# EAGLE design Wilssen_core_v0.208a (EAGLE 6.3)
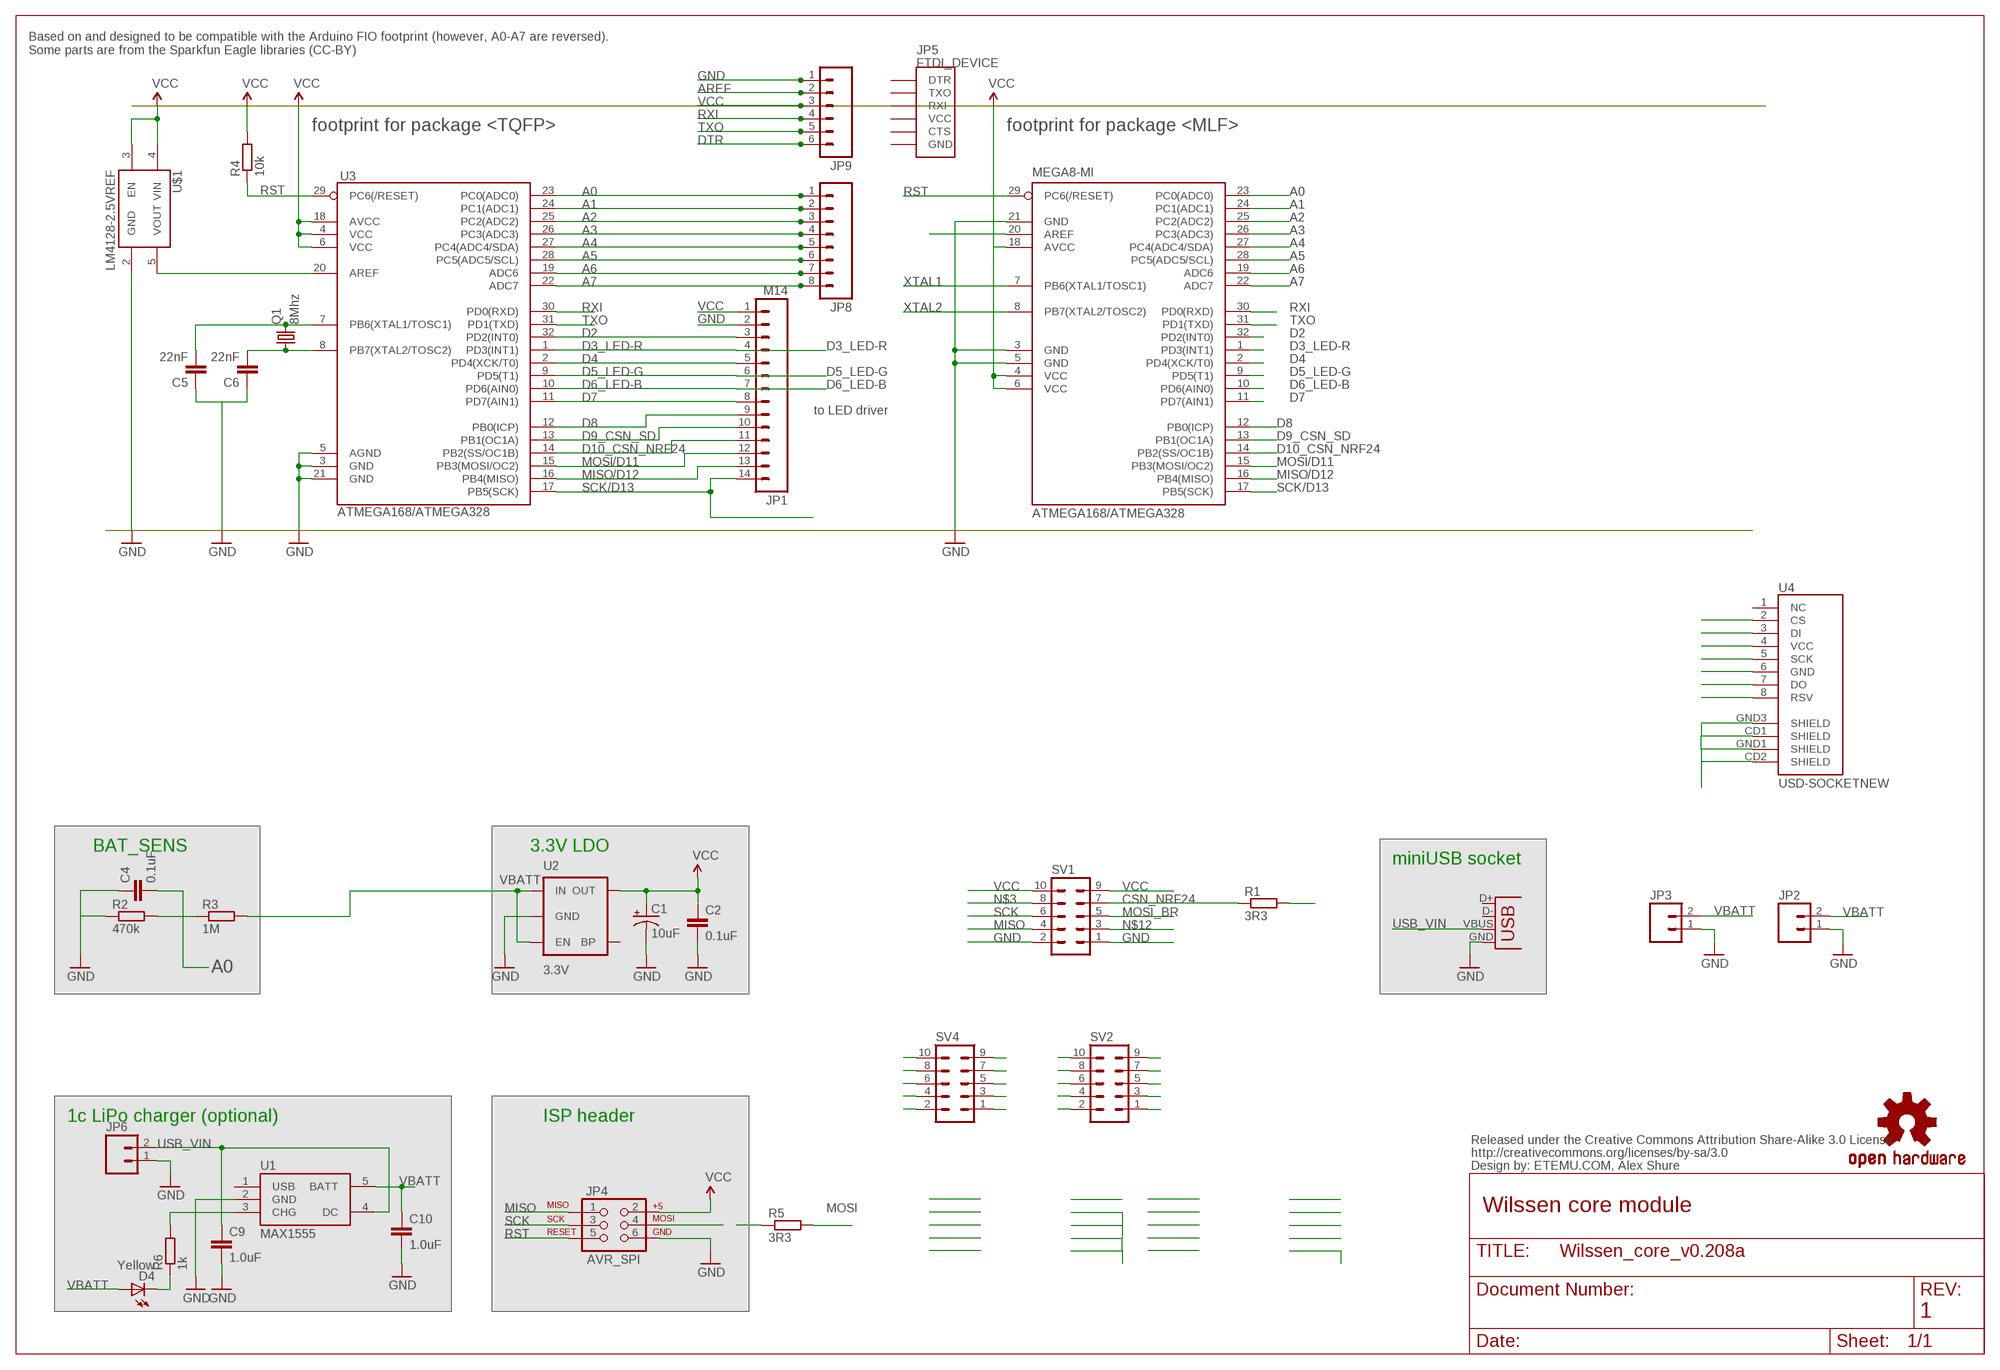
[diagram p0: schematic, sheet 1, part 1 of 2]
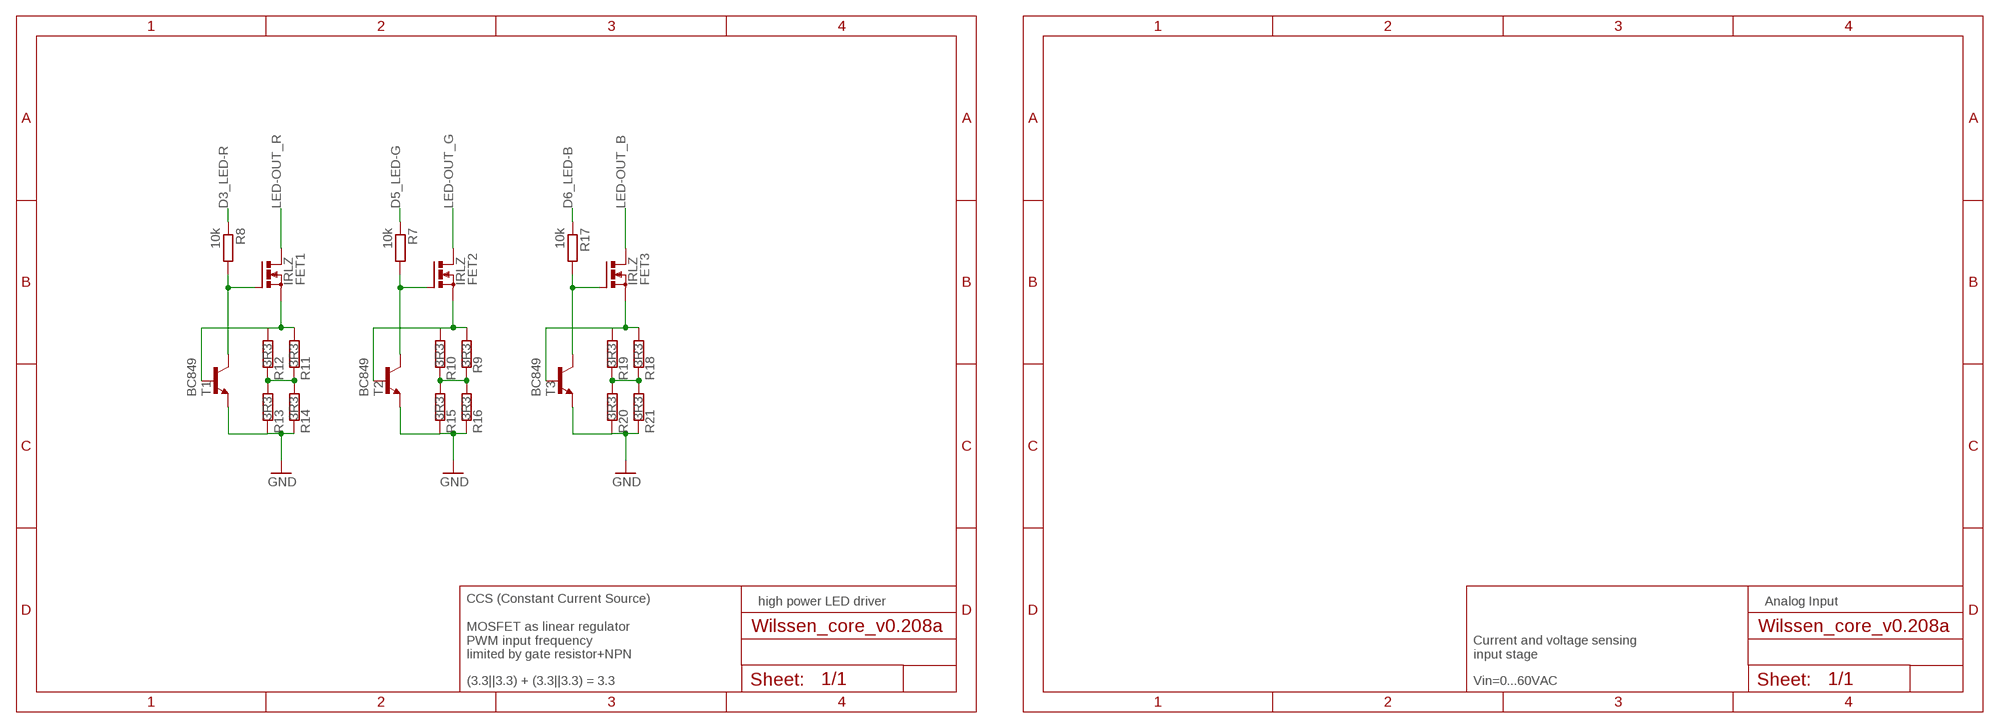
[diagram p1: schematic, sheet 1, part 2 of 2]

## Parts
ATMEGA168/ATMEGA328  MEGA8-MI  [MLF32]
C1  10uF  CAP_POL1206  [EIA3216]
C2  0.1uF  CAP0805  [0805]
C4  0.1uF  CAP0805  [0805]
C5  22nF  CAP0805  [0805]
C6  22nF  CAP0805  [0805]
C9  1.0uF  CAP0805  [0805]
C10  1.0uF  CAP0805  [0805]
CC_TEXT1  CREATIVE_COMMONS  [CREATIVE_COMMONS]
D4  Yellow  LED0603  [LED-0603]
FET1  IRLZ  PMOSFET_NTO220BV  [TO220BV]
FET2  IRLZ  PMOSFET_NTO220BV  [TO220BV]
FET3  IRLZ  PMOSFET_NTO220BV  [TO220BV]
JP1  M14  [1X14]
JP2  M02PTH  [1X02]
JP3  M02-JST-2MM-SMT  [S2B-PH]
JP4  AVR_SPI  AVR_SPI_PRG_6PTH  [2X3]
JP5  FTDI_DEVICE  [FTDI_DEVICE_SIDE]
JP6  M02PTH  [1X02]
JP8  M081X08  [1X08]
JP9  M06SIP  [1X06]
LOGO1  OSHW-LOGOS  [OSHW-LOGO-S]
Q1  8Mhz  CRYSTALSM49  [SM49]
R1  3R3  R-EU_R1206  [R1206]
R2  470k  R-EU_R0805  [R0805]
R3  1M  R-EU_R0805  [R0805]
R4  10k  R-EU_R0805  [R0805]
R5  3R3  R-EU_R1206  [R1206]
R6  1k  R-EU_R0805  [R0805]
R7  10k  R-EU_R0805  [R0805]
R8  10k  R-EU_R0805  [R0805]
R9  3R3  R-EU_R1206  [R1206]
R10  3R3  R-EU_R1206  [R1206]
R11  3R3  R-EU_R1206  [R1206]
R12  3R3  R-EU_R1206  [R1206]
R13  3R3  R-EU_R1206  [R1206]
R14  3R3  R-EU_R1206  [R1206]
R15  3R3  R-EU_R1206  [R1206]
R16  3R3  R-EU_R1206  [R1206]
R17  10k  R-EU_R0805  [R0805]
R18  3R3  R-EU_R1206  [R1206]
R19  3R3  R-EU_R1206  [R1206]
R20  3R3  R-EU_R1206  [R1206]
R21  3R3  R-EU_R1206  [R1206]
SV1  MA05-2  [MA05-2]
SV2  MA05-2  [MA05-2]
SV4  MA05-2  [MA05-2]
T1  BC849  [SOT23]
T2  BC849  [SOT23]
T3  BC849  [SOT23]
U1  MAX1555  [SOT23-5]
U2  3.3V  V_REG_LDOSMD  [SOT23-5]
U3  ATMEGA168/ATMEGA328  ATMEGA168  [TQFP32-08]
U4  USD-SOCKETNEW  [MICRO-SD-SOCKET-PP]
U$1  LM4128-2.5VREF  [SOT23-5]
X1  USBSMD  [USB-MINIB]

## Nets
A0: ATMEGA168/ATMEGA328.23(PC0(ADC0)) C4.2 JP8.1 R2.2 R3.1 U3.23(PC0(ADC0))
A1: ATMEGA168/ATMEGA328.24(PC1(ADC1)) JP8.2 U3.24(PC1(ADC1))
A2: ATMEGA168/ATMEGA328.25(PC2(ADC2)) JP8.3 U3.25(PC2(ADC2))
A3: ATMEGA168/ATMEGA328.26(PC3(ADC3)) JP8.4 U3.26(PC3(ADC3))
A4: ATMEGA168/ATMEGA328.27(PC4(ADC4/SDA)) JP8.5 U3.27(PC4(ADC4/SDA))
A5: ATMEGA168/ATMEGA328.28(PC5(ADC5/SCL)) JP8.6 U3.28(PC5(ADC5/SCL))
A6: ATMEGA168/ATMEGA328.19(ADC6) JP8.7 U3.19(ADC6)
A7: ATMEGA168/ATMEGA328.22(ADC7) JP8.8 U3.22(ADC7)
AREF: ATMEGA168/ATMEGA328.20(AREF) JP9.2 U3.20(AREF) U$1.5(VOUT)
CSN: SV2.8 SV4.8
CSN_NRF24: R1.1 SV1.7
D2: ATMEGA168/ATMEGA328.32(PD2(INT0)) JP1.3 U3.32(PD2(INT0))
D3_LED-R: ATMEGA168/ATMEGA328.1(PD3(INT1)) JP1.4 R8.1 U3.1(PD3(INT1))
D4: ATMEGA168/ATMEGA328.2(PD4(XCK/T0)) JP1.5 U3.2(PD4(XCK/T0))
D5_LED-G: ATMEGA168/ATMEGA328.9(PD5(T1)) JP1.6 R7.1 U3.9(PD5(T1))
D6_LED-B: ATMEGA168/ATMEGA328.10(PD6(AIN0)) JP1.7 R17.1 U3.10(PD6(AIN0))
D7: ATMEGA168/ATMEGA328.11(PD7(AIN1)) JP1.8 U3.11(PD7(AIN1))
D8: ATMEGA168/ATMEGA328.12(PB0(ICP)) JP1.9 U3.12(PB0(ICP))
D9_CSN_SD: ATMEGA168/ATMEGA328.13(PB1(OC1A)) JP1.10 U3.13(PB1(OC1A)) U4.2(CS)
D10_CSN_NRF24: ATMEGA168/ATMEGA328.14(PB2(SS/OC1B)) JP1.11 R1.2 U3.14(PB2(SS/OC1B))
DTR: JP9.6
GATE1: FET1.G R8.2 T1.3(C)
GATE2: FET2.G R7.2 T2.3(C)
GATE3: FET3.G R17.2 T3.3(C)
GND: ATMEGA168/ATMEGA328.3(GND) ATMEGA168/ATMEGA328.5(GND) ATMEGA168/ATMEGA328.21(GND) C1.C(-) C2.2 C4.1 C5.1 C6.1 C9.2 C10.2 JP1.2 JP2.1 JP3.1 JP4.6 JP6.1 JP9.1 R2.1 R13.2 R14.2 R15.2 R16.2 R20.2 R21.2 SV1.1 SV1.2 SV4.1 SV4.3 SV4.5 SV4.7 T1.2(E) T2.2(E) T3.2(E) U1.2(GND) U2.2(GND) U3.3(GND) U3.5(AGND) U3.21(GND) U4.6(GND) U4.CD1(SHIELD) U4.CD2(SHIELD) U4.GND1(SHIELD) U4.GND3(SHIELD) U$1.2(GND) X1.GND
LED-OUT_B: FET3.D
LED-OUT_G: FET2.D
LED-OUT_R: FET1.D
MISO: ATMEGA168/ATMEGA328.16(PB4(MISO)) JP1.13 JP4.1 SV1.4 SV2.2 SV4.2 U3.16(PB4(MISO))
MOSI: ATMEGA168/ATMEGA328.15(PB3(MOSI/OC2)) JP1.12 JP4.4 R5.2 SV2.10 SV4.10 U3.15(PB3(MOSI/OC2))
MOSI_BR: SV1.5
N$1: R5.1
N$3: SV1.8
N$5: U4.3(DI)
N$8: D4.C R6.1
N$11: R6.2 U1.3(CHG)
N$12: SV1.3
N$15: U4.7(DO)
N$16: U4.8(RSV)
NS$1: R11.2 R12.2 R13.1 R14.1
NS$2: R9.2 R10.2 R15.1 R16.1
NS$3: R18.2 R19.2 R20.1 R21.1
RST: ATMEGA168/ATMEGA328.29(PC6(/RESET)) JP4.5 R4.1 SV2.6 SV4.6 U3.29(PC6(/RESET))
RXI: ATMEGA168/ATMEGA328.30(PD0(RXD)) JP9.4 U3.30(PD0(RXD))
SCK: ATMEGA168/ATMEGA328.17(PB5(SCK)) JP1.14 JP4.3 SV1.6 SV2.4 SV4.4 U3.17(PB5(SCK)) U4.5(SCK)
SRC1: FET1.S R11.1 R12.1 T1.1(B)
SRC2: FET2.S R9.1 R10.1 T2.1(B)
SRC3: FET3.S R18.1 R19.1 T3.1(B)
TXO: ATMEGA168/ATMEGA328.31(PD1(TXD)) JP9.5 U3.31(PD1(TXD))
USB_VIN: C9.1 JP6.2 U1.4(DC) X1.VBUS
VBATT: C10.1 D4.A JP2.2 JP3.2 R3.2 U1.5(BATT) U2.1(IN) U2.3(EN)
VCC [VCC]: ATMEGA168/ATMEGA328.4(VCC) ATMEGA168/ATMEGA328.6(VCC) ATMEGA168/ATMEGA328.18(AVCC) C1.A(+) C2.1 JP1.1 JP4.2 JP9.3 R4.2 SV1.9 SV1.10 SV4.9 U2.5(OUT) U3.4(VCC) U3.6(VCC) U3.18(AVCC) U4.4(VCC) U$1.3(EN) U$1.4(VIN)
XTAL1: ATMEGA168/ATMEGA328.7(PB6(XTAL1/TOSC1)) C5.2 Q1.2 U3.7(PB6(XTAL1/TOSC1))
XTAL2: ATMEGA168/ATMEGA328.8(PB7(XTAL2/TOSC2)) C6.2 Q1.1 U3.8(PB7(XTAL2/TOSC2))
Unconnected: JP5.P$1(DTR) JP5.P$2(TXO) JP5.P$3(RXI) JP5.P$4(VCC) JP5.P$5(CTS) JP5.P$6(GND) SV2.1 SV2.3 SV2.5 SV2.7 SV2.9 U1.1(USB) U2.4(BP) U4.1(NC) X1.D+ X1.D-

## Notes on the sheet
- Based on and designed to be compatible with the Arduino FIO footprint (however, A0-A7 are reversed).
  Some parts are from the Sparkfun Eagle libraries (CC-BY)
- footprint for package <TQFP> | footprint for package <MLF>
- to LED driver
- /D11 | /D11
- /D12 | /D12
- /D13 | /D13
- BAT_SENS | 3.3V LDO
- miniUSB socket
- 1c LiPo charger (optional) | ISP header
- ETEMU.COM, Alex Shure
- Wilssen core module
- high power LED driver | Analog Input
- CCS (Constant Current Source)
  
  MOSFET as linear regulator
  PWM input frequency
  limited by gate resistor+NPN
- Current and voltage sensing
  input stage
- 1
- (3.3||3.3) + (3.3||3.3) = 3.3 | Vin=0...60VAC

## Library data of the parts
ATMEGA168/ATMEGA328 = atmel:MEGA8: MICROCONTROLLER 8 Kbytes FLASH, 1 kbytes SRAM, 512 bytes EEPROM, USART, 6-channel 10 bit ADC, 2-channel 8 bit ADC Pin compatible with Atmega48, ATMega88, ATMega168 Source: avr.lbr; MPN: ATMEGA88PA-MU; OC_FARNELL: 1715491; OC_NEWARK: 15R0272
C1 = SparkFun:CAP_POL: Capacitor Polarized These are standard SMD and PTH capacitors. Normally 10uF, 47uF, and 100uF in electrolytic and tantalum varieties. Always verify the external diameter of the through hole cap, it varies with capacity, voltage, and manufacturer. The EIA devices should be standard.
C2 C4-C6 C9 C10 = SparkFun:CAP: Capacitor Standard 0603 ceramic capacitor, and 0.1" leaded capacitor.
CC_TEXT1 = SparkFun-Aesthetics:CREATIVE_COMMONS: Creative Commons License summary
D4 = SparkFun:LED: LEDs Standard schematic elements and footprints for 5mm, 3mm, 1206, and 0603 sized LEDs. 5mm - Spark Fun Electronics SKU : COM-00529 (and others)
FET1-FET3 = transistor-power:PMOSFET_N: Power MOSFET N-Channel
JP1 = SparkFun:M14: Header 14 Standard 14-pin 0.1" header. Use with straight break away headers (SKU : PRT-00116), right angle break away headers (PRT-00553), swiss pins (PRT-00743), machine pins (PRT-00117), and female headers (PRT-00115).
JP2 JP3 JP6 = SparkFun:M02: Header 2 Standard 2-pin 0.1" header. Use with straight break away headers (SKU : PRT-00116), right angle break away headers (PRT-00553), swiss pins (PRT-00743), machine pins (PRT-00117), and female headers (PRT-00115). Molex polarized connector foot print use with SKU : PRT-08233 with associated crimp pins and housings.
JP4 = SparkFun:AVR_SPI_PRG_6: AVR ISP 6 Pin This is the reduced ISP connector for AVR programming. Common on Arduino. This footprint will take up less PCB space and can be used with a 10-pin to 6-pin adapter such as SKU: BOB-08508
JP5 = SparkFun-Connectors:FTDI_DEVICE: Connector which mates to FTDI basic or FTDI cable.
JP8 = SparkFun-Connectors:M08: Header 8 Standard 8-pin 0.1" header. Use with straight break away headers (SKU : PRT-00116), right angle break away headers (PRT-00553), swiss pins (PRT-00743), machine pins (PRT-00117), and female headers (PRT-00115).
JP9 = SparkFun-Connectors:M06: Header 6 Standard 6-pin 0.1" header. Use with straight break away headers (SKU : PRT-00116), right angle break away headers (PRT-00553), swiss pins (PRT-00743), machine pins (PRT-00117), and female headers (PRT-00115). Molex polarized connector foot print use with SKU : PRT-08094 with associated crimp pins and housings. NOTES ON THE VARIANTS LOCK and LOCK_LONGPADS... This footprint was designed to help hold the alignment of a through-hole component (i.e. 6-pin header) while soldering it into place. You may notice that each hole has been shifted either up or down by 0.005 of an inch from it's more standard position (which is a perfectly straight line). This slight alteration caused the pins (the squares in the middle) to touch the edges of the holes. Because they are alternating, it causes a "brace" to hold the component in place. 0.005 has proven to be the perfect amount of "off-center" position when using our standard breakaway headers. Although looks a little odd when you look at the bare footprint, once you have a header in there, the alteration is very hard to notice. Also, if you push a header all the way into place, it is covered up entirely on the bottom side. This idea of altering the position of holes to aid alignment will be further integrated into the Sparkfun Library for other footprints. It can help hold any component with 3 or more connection pins.
LOGO1 = SparkFun-Aesthetics:OSHW-LOGO: Open Source Hardware Logo This logo indicates the piece of hardware it is found on incorporates a OSHW license and/or adheres to the definition of open source hardware found here: http://freedomdefined.org/OSHW
Q1 = crystal:CRYSTAL: CRYSTAL; OC_FARNELL: unknown; OC_NEWARK: unknown
R1-R6 = rcl:R-EU_: RESISTOR, European symbol
R7-R21 = resistor:R-EU_: RESISTOR, European symbol
SV1 SV2 SV4 = con-lstb:MA05-2: PIN HEADER; OC_FARNELL: unknown; OC_NEWARK: unknown
T1-T3 = transistor:BC849: NPN TRANSISTOR
U1 = SparkFun:MAX1555: MAX1555 Lithium Charger IC SOT-23 Lithium Polymer charging IC. Schematic element and footprint proven. Spark Fun Electronics SKU : COM-00674
U2 = SparkFun:V_REG_LDO: Voltage Regulator LDO Standard 150mA LDO voltage regulator in SOT-23 layout. Micrel part MIC5205. BP (by-pass) pin is used to lower output noise with 470pF cap.
U3 = SparkFun:ATMEGA168
U4 = SparkFun-Connectors:USD-SOCKET: microSD Socket Push-push type uSD socket. Schematic element and footprint production proven. Spark Fun Electronics SKU : PRT-00127. tDoc lines correctly indicate media card edge positions when inserting (unlocked, locked, depressed).
U$1 = SparkFun-PowerIC:LM4128-2.5VREF: .1% accurate low-current voltage reference
X1 = SparkFun:USB: USB Connectors USB-B-PTH is fully proven SKU : PRT-00139 USB-miniB is fully proven SKU : PRT-00587 USB-A-PCB is untested. USB-A-H is throughly reviewed, but untested. Spark Fun Electronics SKU : PRT-00437 USB-B-SMT is throughly reviewed, but untested. Needs silkscreen touching up. USB-A-S has not been used/tested USB-MB-H has not been used/tested

## Net classes
0 Default: width 0.203 mm
1 VCC: width 0.381 mm
2 LEDPower: width 0.203 mm
3 ButtonSignal: width 0.203 mm

## Board
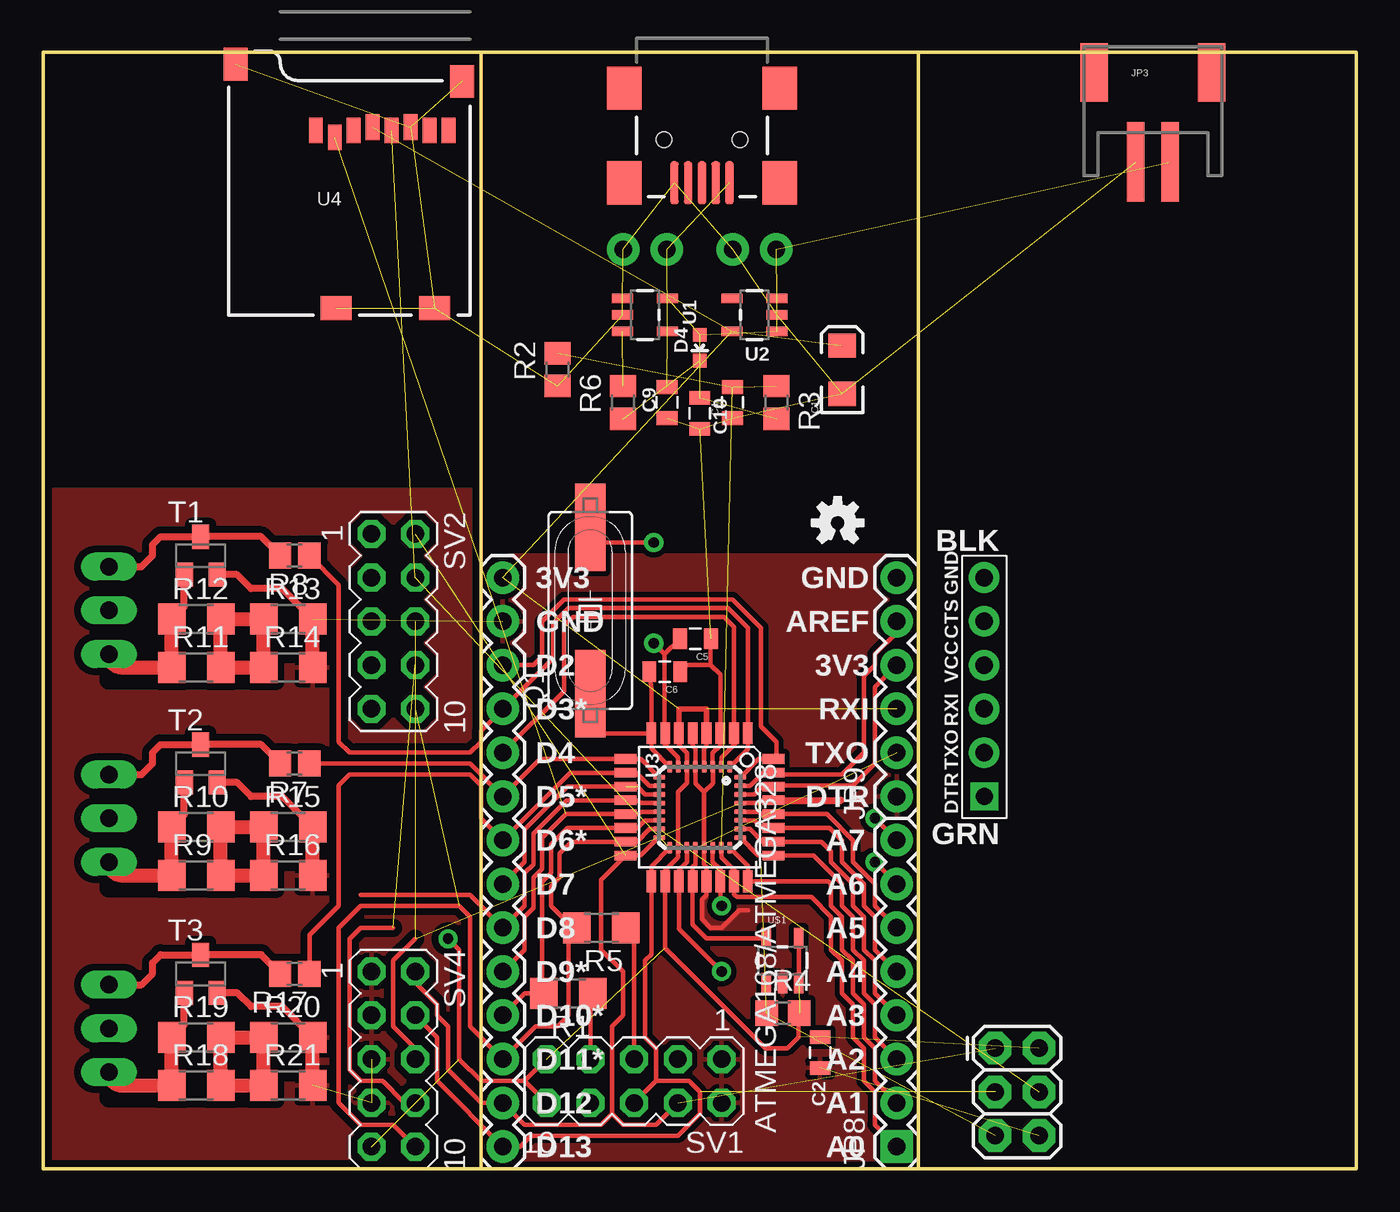
[diagram p2: board, top side]
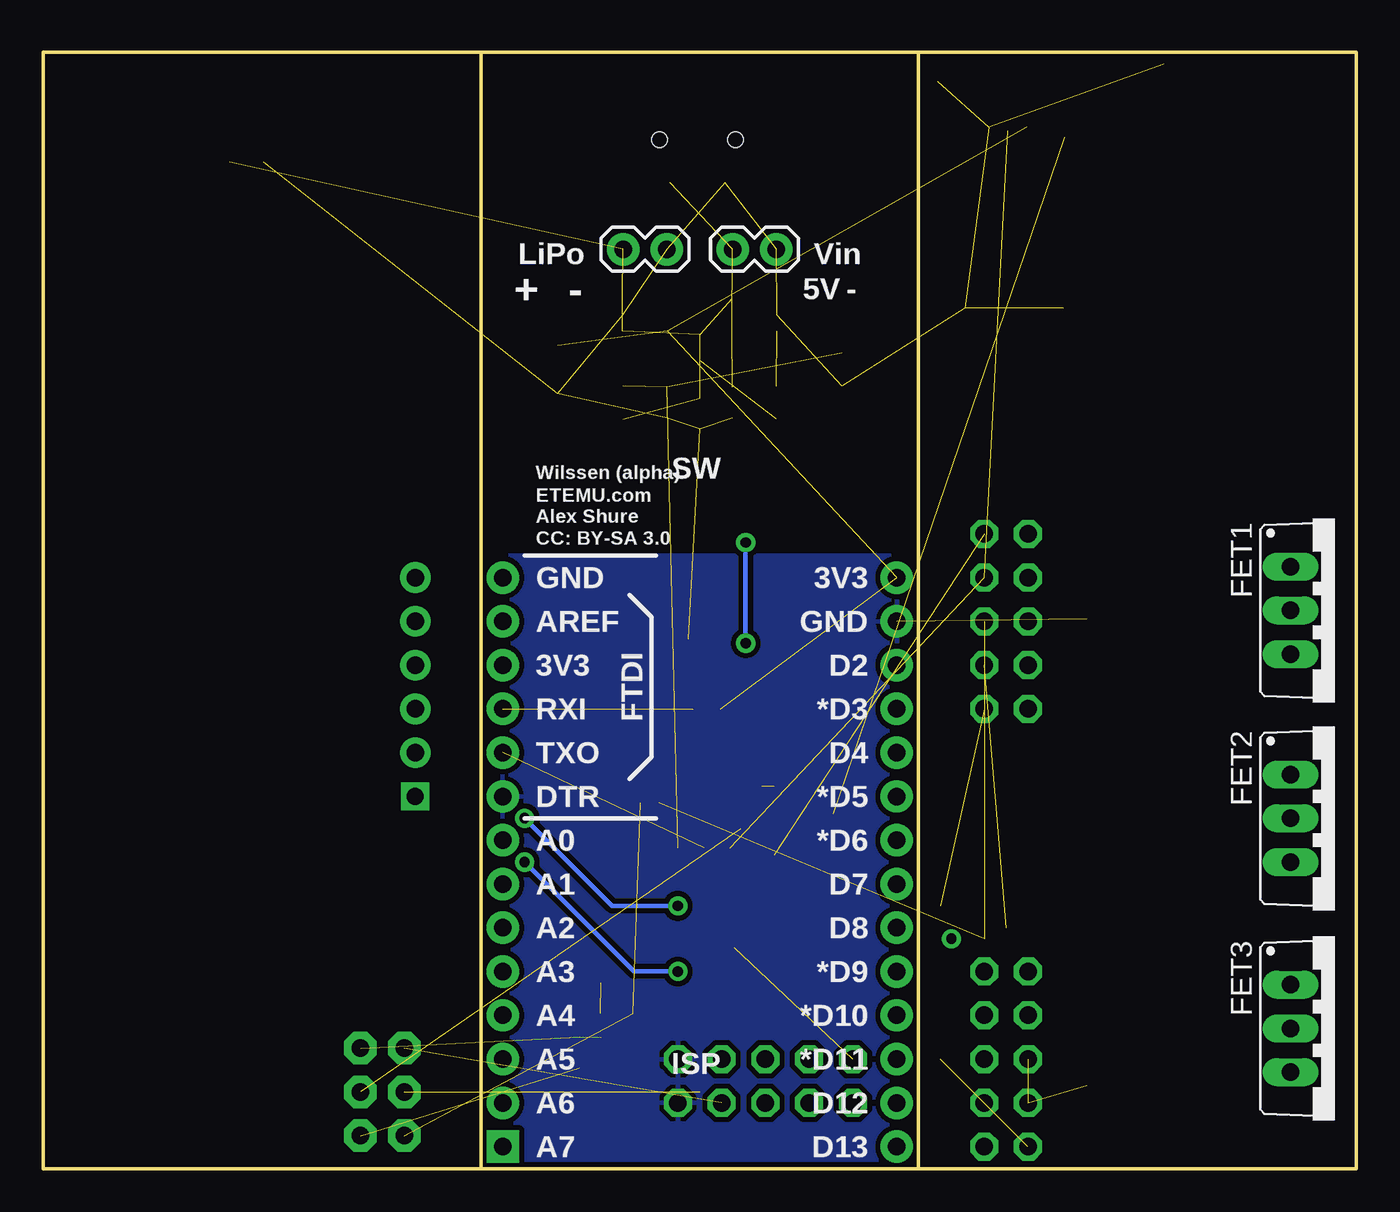
[diagram p3: board, bottom side, seen from below]

Size 76.2 x 64.77 mm. Coordinates in mm from the lower left corner, seen from the top.
Outline: 50.8,64.77 50.8,0
Outline: 50.8,0 25.4,0
Outline: 25.4,0 25.4,64.77
Outline: 25.4,0 0,0 0,64.77 25.4,64.77
Outline: 50.8,0 76.2,0 76.2,64.77 50.8,64.77
Outline: 25.4,64.77 50.8,64.77
Copper layers (1*16): Top 0.035mm / dielectric 1.5mm / Bottom 0.035mm
Design rules "SparkFun *": minimum track width 8mil, minimum drill 20mil, track to track 8mil, track to pad 8mil, pad to pad 8mil, via to via 8mil, smd to smd 8mil, copper to edge 10mil, drill to drill 8mil, minimum pad ring 12mil, minimum via ring 10mil, stop-mask expansion 4mil, vias tented up to drill 25mil, thermal gap 10mil
tRestrict: area 35.6,19 to 40.6,22.9; area 3.8,28.3 to 16.5,35.6; area 3.8,16.3 to 16.5,23.5; area 3.8,4.1 to 15.2,11.3; area 29.2,23.5 to 41.3,33

### Footprints (pad centres in the part's own frame; a part is rotated, then mirrored left to right if it is on the bottom)
MLF32 = smd 0.7 x 0.3: 1 -2.35,1.75; 2 -2.35,1.25; 3 -2.35,0.75; 4 -2.35,0.25; 5 -2.35,-0.25; 6 -2.35,-0.75; 7 -2.35,-1.25; 8 -2.35,-1.75; 17 2.35,-1.75; 18 2.35,-1.25; 19 2.35,-0.75; 20 2.35,-0.25; 21 2.35,0.25; 22 2.35,0.75; 23 2.35,1.25; 24 2.35,1.75 | smd 0.3 x 0.7: 9 -1.75,-2.35; 10 -1.25,-2.35; 11 -0.75,-2.35; 12 -0.25,-2.35; 13 0.25,-2.35; 14 0.75,-2.35; 15 1.25,-2.35; 16 1.75,-2.35; 25 1.75,2.35; 26 1.25,2.35; 27 0.75,2.35; 28 0.25,2.35; 29 -0.25,2.35; 30 -0.75,2.35; 31 -1.25,2.35; 32 -1.75,2.35
EIA3216 = smd 1.4 x 1.6: A 1.4,0; C -1.4,0
0805 = smd 0.8 x 1.2: 1 -0.9,0; 2 0.9,0
LED-0603 = smd 0.8 x 0.8: A 0,-0.75; C 0,0.75
TO220BV = drill 1.016 long: D 0,-2.54; G -2.54,-2.54; S 2.54,-2.54
1X14 = drill 1.016 pad 1.88: 1 0,0; 2 2.54,0; 3 5.08,0; 4 7.62,0; 5 10.16,0; 6 12.7,0; 7 15.24,0; 8 17.78,0; 9 20.32,0; 10 22.86,0; 11 25.4,0; 12 27.94,0; 13 30.48,0; 14 33.02,0
1X02 = drill 1.016 pad 1.88: 1 0,0; 2 2.54,0
S2B-PH = smd 1 x 4.6: 1 -1,-3.7; 2 1,-3.7 | smd 1.6 x 3.4: NC1 -3.4,1.5; NC2 3.4,1.5
2X3 = drill 1.016 pad 1.88 octagon: 1 0,0; 2 0,2.54; 3 2.54,0; 4 2.54,2.54; 5 5.08,0; 6 5.08,2.54
FTDI_DEVICE_SIDE = drill 1 square: P$1 -6.35,0 | drill 1.016 pad 1.778: P$2 -3.81,0; P$3 -1.27,0; P$4 1.27,0; P$5 3.81,0; P$6 6.35,0
1X08 = drill 1.016 pad 1.88 square: 1 0,0 | drill 1.016 pad 1.88: 2 2.54,0; 3 5.08,0; 4 7.62,0; 5 10.16,0; 6 12.7,0; 7 15.24,0; 8 17.78,0
1X06 = drill 1.016 pad 1.88: 1 0,0; 2 2.54,0; 3 5.08,0; 4 7.62,0; 5 10.16,0; 6 12.7,0
SM49 = smd 5.08 x 1.778: 1 -4.826,0; 2 4.826,0
R1206 = smd 1.6 x 1.803: 1 -1.422,0; 2 1.422,0
R0805 = smd 1.3 x 1.5: 1 -0.95,0; 2 0.95,0
R0805' = smd 1.3 x 1.5: 1 -0.85,0; 2 0.85,0
MA05-2 = drill 1.016 octagon: 1 -5.08,-1.27; 2 -5.08,1.27; 3 -2.54,-1.27; 4 -2.54,1.27; 5 0,-1.27; 6 0,1.27; 7 2.54,-1.27; 8 2.54,1.27; 9 5.08,-1.27; 10 5.08,1.27
SOT23 = smd 1 x 1.4: 1 -0.95,-1.1; 2 0.95,-1.1; 3 0,1.1
SOT23-5 = smd 0.55 x 1.2: 1 -0.95,-1.3; 2 0,-1.3; 3 0.95,-1.3; 4 0.95,1.3; 5 -0.95,1.3
TQFP32-08 = smd 1.27 x 0.559: 1 -4.293,2.8; 2 -4.293,2; 3 -4.293,1.2; 4 -4.293,0.4; 5 -4.293,-0.4; 6 -4.293,-1.2; 7 -4.293,-2; 8 -4.293,-2.8; 17 4.293,-2.8; 18 4.293,-2; 19 4.293,-1.2; 20 4.293,-0.4; 21 4.293,0.4; 22 4.293,1.2; 23 4.293,2; 24 4.293,2.8 | smd 0.559 x 1.27: 9 -2.8,-4.293; 10 -2,-4.293; 11 -1.2,-4.293; 12 -0.4,-4.293; 13 0.4,-4.293; 14 1.2,-4.293; 15 2,-4.293; 16 2.8,-4.293; 25 2.8,4.293; 26 2,4.293; 27 1.2,4.293; 28 0.4,4.293; 29 -0.4,4.293; 30 -1.2,4.293; 31 -2,4.293; 32 -2.8,4.293
MICRO-SD-SOCKET-PP = smd 0.8 x 1.5: 1 -8.94,10.7; 2 -7.84,10.3; 3 -6.74,10.7; 4 -5.64,10.9; 5 -4.54,10.7; 6 -3.44,10.9; 7 -2.34,10.7; 8 -1.24,10.7 | smd 1.8 x 1.4: CD1 -2.05,0.4; CD2 -7.75,0.4 | smd 1.4 x 1.9: GND1 -13.6,14.55; GND3 -0.45,13.55
USB-MINIB = smd 2.5 x 0.508: D+ 2.5,0; D- 2.5,0.8; GND 2.5,-1.6; ID 2.5,-0.8; VBUS 2.5,1.6 | smd 2.5 x 2: GND@1 -3,-4.5; GND@2 -3,4.5; GND@3 2.5,4.5; GND@4 2.5,-4.5 | hole 0.9: 0,2.2; 0,-2.2

### Placement (x,y rotation side)
ATMEGA168/ATMEGA328  38.1,20.95 270 top
C1  46.36,46.35 90 top
C2  45.09,6.73 270 top
C4  40.01,44.45 90 top
C5  37.85,30.73 180 top
C6  36.07,28.83 180 top
C9  36.2,44.45 270 top
C10  38.1,43.81 270 top
CC_TEXT1  17.15,-8.26 0 top  (outside the outline)
D4  38.1,47.62 180 top
FET1  1.27,32.38 270 bottom
FET2  1.27,20.32 270 bottom
FET3  1.27,8.13 270 bottom
JP1  26.67,34.29 270 top
JP2  40.01,53.34 180 bottom
JP3  64.39,62.1 0 top
JP4  55.25,6.99 270 top
JP5  54.61,27.94 90 top
JP6  33.66,53.34 180 bottom
JP8  49.53,1.27 90 top
JP9  49.53,21.59 90 top
LOGO1  46.1,37.47 0 top
Q1  31.75,32.38 90 top
R1  30.48,10.16 180 top
R2  29.84,46.35 90 top
R3  42.55,44.45 270 top
R4  42.93,9.02 0 top
R5  32.39,13.97 180 top
R6  33.66,44.45 90 top
R7  10k  [R0805']  14.6,23.5 180 top
R8  10k  [R0805']  14.6,35.56 180 top
R9  8.89,17.02 0 top
R10  8.89,19.81 0 top
R11  8.89,29.08 0 top
R12  8.89,31.88 0 top
R13  14.22,31.88 0 top
R14  14.22,29.08 0 top
R15  14.22,19.81 0 top
R16  14.22,17.02 0 top
R17  10k  [R0805']  14.6,11.3 180 top
R18  8.89,4.83 0 top
R19  8.89,7.62 0 top
R20  14.22,7.62 0 top
R21  14.22,4.83 0 top
SV1  34.29,5.08 180 top
SV2  20.32,31.75 270 top
SV4  20.32,6.35 270 top
T1  9.14,35.56 0 top
T2  9.14,23.5 0 top
T3  9.14,11.3 0 top
U1  34.93,49.53 270 top
U2  41.27,49.53 90 top
U3  38.09,20.96 270 top
U4  24.77,49.53 0 top
U$1  42.9,12.06 0 top
X1  38.23,59.69 270 top

### Tracks (layer width: path | path; a pad name or v marks a point on that pad's centre or on a via)
A0  (3 unrouted)
  Top 0.254: ATMEGA168/ATMEGA328.23 39.35,18.05 40.13,17.27 40.09,17.23 U3.23 40.09,15.92 40.26,15.75 44.58,15.75 45.72,14.61 45.72,12.7 46.36,12.06 46.36,10.16 46.99,9.53 46.99,7.62 47.62,6.99 47.62,5.08 48.26,4.45 48.26,2.54 JP8.1
A1
  Top 0.254: ATMEGA168/ATMEGA328.24 40.89,17.57 U3.24 45.56,16.67 45.72,16.51 45.72,15.24 46.36,14.61 46.36,12.7 46.99,12.06 46.99,10.16 47.62,9.53 47.62,7.62 48.26,6.99 48.26,5.08 JP8.2
A2
  Top 0.254: ATMEGA168/ATMEGA328.25 41.49,18.16 U3.25 44.7,18.16 46.36,16.51 46.36,15.24 46.99,14.61 46.99,12.7 47.62,12.06 47.62,10.16 48.26,9.53 48.26,7.62 JP8.3
A3
  Top 0.254: ATMEGA168/ATMEGA328.26 41,19.7 41.74,18.96 U3.26 45.17,18.96 45.72,18.41 45.72,17.78 46.99,16.51 46.99,15.24 47.62,14.61 47.62,12.7 48.26,12.06 48.26,10.16 JP8.4
A4
  Top 0.254: ATMEGA168/ATMEGA328.27 41.26,20.2 41.7,19.77 U3.27 45.64,19.77 46.36,19.05 46.36,17.78 47.62,16.51 47.62,15.24 48.26,14.61 48.26,12.7 JP8.5
A5
  Top 0.254: ATMEGA168/ATMEGA328.28 41.52,20.7 41.66,20.57 U3.28 45.48,20.57 46.99,19.05 46.99,17.78 48.26,16.51 48.26,15.24 JP8.6
A6  (via drill 0.6)
  Top 0.254: ATMEGA168/ATMEGA328.19 37.35,17.79 36.89,17.33 U3.19 36.89,13.91 v39.37,11.43 | v48.26,17.78 JP8.7
  Bottom 0.254: v39.37,11.43 41.91,11.43 v48.26,17.78
A7  (via drill 0.6)
  Top 0.254: ATMEGA168/ATMEGA328.22 38.85,17.79 39.29,17.35 U3.22 39.29,15.24 v39.37,15.24 | v48.26,20.32 JP8.8
  Bottom 0.254: v39.37,15.24 43.18,15.24 v48.26,20.32
AREF  (1 unrouted)
  Top 0.254: ATMEGA168/ATMEGA328.20 37.85,17.65 37.69,17.5 U3.20 37.69,14.18 38.5,13.37 U$1.5
CSN  (1 unrouted)
  Top 0.254: SV4.8 20.95,3.81 19.69,5.08 18.41,5.08 17.78,5.71 17.78,13.34 18.41,13.97 20.32,13.97
CSN_NRF24
  Top 0.254: SV1.7 31.75,10.01 R1.1
D2
  Top 0.254: ATMEGA168/ATMEGA328.32 41.51,23.77 U3.32 42.55,23.93 42.55,24.77 41.66,25.65 41.66,31.37 40.01,33.02 30.23,33.02 28.96,31.75 28.96,29.72 28.45,29.21 JP1.3
D3_LED-R
  Top 0.254: ATMEGA168/ATMEGA328.1 40.89,24.34 U3.1 40.89,31.37 39.75,32.51 30.48,32.51 29.59,31.62 29.59,29.59 JP1.4 25.4,25.4 25.4,24.77 24.77,24.13 17.78,24.13 17.15,24.77 17.15,33.87 R8.1
D4
  Top 0.254: ATMEGA168/ATMEGA328.2 39.35,23.86 40.13,24.64 40.09,24.68 U3.2 40.09,31.41 39.5,32 30.73,32 30.23,31.5 30.23,27.69 JP1.5
D5_LED-G
  Top 0.254: ATMEGA168/ATMEGA328.9 34.69,23.77 U3.9 28.84,23.77 JP1.6 24.77,23.5 R7.1
D6_LED-B
  Top 0.254: ATMEGA168/ATMEGA328.10 35.2,22.2 34.44,22.96 U3.10 30.59,22.96 JP1.7 25.4,20.32 25.4,22.23 24.77,22.86 17.78,22.86 17.15,22.23 17.15,15.24 15.46,13.55 R17.1
D7  (1 unrouted)
  Top 0.254: ATMEGA168/ATMEGA328.11 34.94,21.7 34.48,22.16 | JP1.8 27.94,17.78 27.94,19.68 30.42,22.16 U3.11
D8
  Top 0.254: ATMEGA168/ATMEGA328.12 34.68,21.2 34.54,21.34 33.83,21.34 U3.12 30.38,21.36 28.45,19.43 28.45,17.65 27.94,17.14 27.94,15.24 JP1.9 24.77,15.88 18.41,15.88
D9_CSN_SD  (1 unrouted)
  Top 0.254: ATMEGA168/ATMEGA328.13 34.68,20.7 34.54,20.57 U3.13 30.34,20.57 28.96,19.18 28.96,17.4 28.45,16.89 28.45,15.11 27.94,14.61 27.94,12.7 JP1.10
D10_CSN_NRF24
  Top 0.254: ATMEGA168/ATMEGA328.14 34.94,20.2 34.5,19.77 U3.14 30.43,19.77 29.46,18.8 29.46,17.14 28.96,16.64 28.96,10.26 R1.2 27.94,10.16 JP1.11
GATE1
  Top 0.406: R8.2 12.65,36.66 T1.3 6.81,36.66 6.35,36.2 6.35,35.56 5.71,34.92 FET1.G
GATE2
  Top 0.406: R7.2 12.65,24.59 T2.3 6.81,24.59 6.35,24.13 6.35,23.5 5.71,22.86 FET2.G
GATE3
  Top 0.406: R17.2 12.65,12.4 T3.3 6.81,12.4 6.35,11.94 6.35,11.3 5.71,10.67 FET3.G
GND  (20 unrouted)
  Top 0.254: U3.5 37.69,24.54 37.85,24.38 ATMEGA168/ATMEGA328.5 37.85,22.36 37.85,22.35 38.35,21.85 | U3.21 38.35,16.81 | 38.35,21.85 ATMEGA168/ATMEGA328.21 38.35,17.65 38.49,17.52 U3.21 | 38.35,21.85 38.36,21.85 38.86,22.35 38.86,23.29 ATMEGA168/ATMEGA328.3 38.85,24.12 39.29,24.56 U3.3 39.29,28.66 38.73,29.21 | U3.21 38.49,15.88 38.23,15.62 38.23,14.48 38.73,13.97 39.37,13.97 40.39,14.99 40.89,14.99 | 38.73,29.21 38.73,30.72 C5.1 | 38.73,29.21 37.35,29.21 C6.1
  Top 0.406: R13.2 13.87,33.66 12.06,33.66 11.26,34.46 T1.2 | R15.2 13.87,21.59 12.06,21.59 11.26,22.39 T2.2 | R20.2 13.87,9.4 12.06,9.4 11.26,10.2 T3.2
  Top 0.813: R14.2 R13.2 | R16.2 R15.2 | R21.2 R20.2
  pour Top (isolate 0.305): 25.4,35.56 50.8,35.56 50.8,0 25.4,0
  pour Bottom (isolate 0.305): 25.4,35.56 50.8,35.56 50.8,0 25.4,0
  pour Top (isolate 0.406): 0,0 27.94,0 27.94,35.56 25.4,35.56 25.4,39.37 0,39.37
MISO  (2 unrouted)
  Top 0.254: ATMEGA168/ATMEGA328.16 35.72,19.2 34.68,18.16 U3.16 32.39,16.75 32.39,12.7 33.66,11.43 33.66,8.89 33.02,8.26 33.02,3.17 | 33.02,3.17 33.66,2.54 35.56,2.54 SV1.4 | 33.02,3.17 32.39,2.54 27.94,2.54 JP1.13 25.4,3.81 23.49,5.71 23.49,8.26 22.86,8.89 22.86,9.53 21.59,10.79 SV4.2
MOSI  (2 unrouted)
  Top 0.254: ATMEGA168/ATMEGA328.15 35.2,19.7 34.46,18.96 U3.15 30.65,18.96 29.97,18.29 29.97,16.89 29.46,16.38 29.46,15.24 30.73,13.97 R5.2 30.48,13.97 30.48,8.89 29.84,8.26 28.58,8.26 JP1.12 24.77,8.26 24.77,14.61 24.13,15.24 18.41,15.24 17.15,13.97 17.15,3.81 18.41,2.54 20.32,2.54 SV4.10
MOSI_BR
  Top 0.254: 34.29,13.49 SV1.5
N$1
  Top 0.254: R5.1 33.81,13.82
N$8  (1 unrouted)
N$11  (1 unrouted)
NS$1
  Top 0.813: R14.1 R13.1 R12.2 R11.2 12.57,29.08 arc90 12.7,29.21
NS$2
  Top 0.813: R16.1 R15.1 R10.2 R9.2 12.57,17.02 arc90 12.7,17.14
NS$3
  Top 0.813: R21.1 R20.1 R19.2 R18.2 12.57,4.83 arc90 12.7,4.95
RST  (4 unrouted)
  Top 0.254: ATMEGA168/ATMEGA328.29 41.52,21.2 41.69,21.36 U3.29 | SV4.6 21.59,6.99 20.32,8.26 20.32,12.06 21.59,13.34
  Top 0.406: U3.29 46.31,21.36
RXI
  Top 0.254: ATMEGA168/ATMEGA328.30 41.26,21.7 41.72,22.16 U3.30 42.55,22.23 46.99,22.23 48.26,23.5 48.26,27.94 JP9.4
SCK  (3 unrouted)
  Top 0.254: ATMEGA168/ATMEGA328.17 35.29,17.55 U3.17 35.29,12.43 34.93,12.06 34.93,7.62 35.56,6.99 35.56,5.08 | 35.56,5.08 SV1.6 | 35.56,5.08 37.47,5.08 38.1,4.45 38.1,3.17 36.83,1.91 28.32,1.91 27.69,1.27 JP1.14 22.86,5.08 22.86,7.62 SV4.4
SRC1
  Top 0.406: R12.1 8.19,32.6 T1.1
  Top 0.813: R12.1 R11.1 4.57,29.08 arc-90 FET1.S
SRC2
  Top 0.406: R10.1 8.19,20.54 T2.1
  Top 0.813: R10.1 R9.1 4.57,17.02 arc-90 FET2.S
SRC3
  Top 0.406: R19.1 8.19,8.35 T3.1
  Top 0.813: R19.1 R18.1 4.57,4.83 arc-90 FET3.S
TXO
  Top 0.254: ATMEGA168/ATMEGA328.31 41,22.2 41.76,22.96 U3.31 42.55,22.86 46.36,22.86 47.62,24.13 47.62,28.57 48.26,29.21 48.26,29.84 49.53,31.11 JP9.5
USB_VIN  (3 unrouted)
VBATT  (7 unrouted)
VCC  (via drill 0.6)  (10 unrouted)
  Top 0.254: U3.6 36.89,24.58 37.35,24.12 ATMEGA168/ATMEGA328.6 37.35,22.36 36.85,21.86 ATMEGA168/ATMEGA328.18 36.85,18.05 36.09,17.29 U3.18 36.08,16.66 36.08,12.82 41.91,6.99 43.18,6.99 43.82,7.62 43.82,8.96 R4.2 | ATMEGA168/ATMEGA328.4 38.35,24.38 38.49,24.52 U3.4 | U$1.4 U$1.3 | 27.94,5.08 SV1.9 | SV1.10 27.94,5.08 | 27.94,5.08 25.4,5.08 24.13,6.35 24.13,12.7 v23.49,13.34
  Top 0.305: U3.4 38.49,26.67 36.89,26.67 U3.6 | U3.18 36.08,16.67
XTAL1  (via drill 0.6)
  Top 0.254: ATMEGA168/ATMEGA328.7 36.85,23.86 36.07,24.64 36.09,24.66 U3.7 36.07,25.28 36.07,29.84 | v35.43,36.32 32.64,36.32 Q1.2 | v35.43,30.48 36.07,29.84 | C5.2 36.07,29.84
  Bottom 0.254: v35.43,36.32 v35.43,30.48
XTAL2
  Top 0.254: ATMEGA168/ATMEGA328.8 35.29,24.36 U3.8 | U3.8 31.89,25.26 31.75,25.4 Q1.1 | C6.2 35.29,27.82 U3.8

### Text on the board
tPlace: GND | 3V3 | AREF | GND | 3V3 | D2 | RXI | D3* | TXO | D4 | DTR | D5* | D6* | A7 | D7 | A6 | D8 | A5 | D9* | A4 | D10* | A3 | D11* | A2 | D12 | A1 | D13 | A0
bPlace: Vin | LiPo | - | 5V | - | + | SW | Wilssen (alpha) | ETEMU.com / Alex Shure | CC: BY-SA 3.0 | 3V3 | GND | GND | AREF | D2 | FTDI | 3V3 | *D3 | RXI | D4 | TXO | *D5 | DTR | *D6 | A0 | D7 | A1 | D8 | A2 | *D9 | A3 | *D10 | A4 | *D11 | A5 | ISP | D12 | A6 | D13 | A7
tValues: LED DRiVER | WiLSSEN | TiVA iNPUT | THE LiGHT | THE MATH | THE POWER | Alex Shure